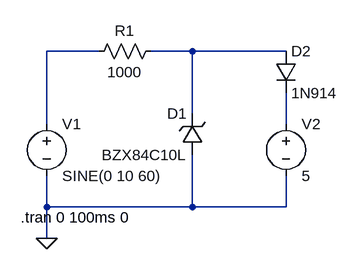
[diagram p0: schematic Sim_1.asc]
Sim_1.asc, the LTspice schematic file:
Version 4.1
SHEET 1 880 680
WIRE 160 0 80 0
WIRE 304 0 240 0
WIRE 448 0 304 0
WIRE 304 96 304 0
WIRE 80 112 80 0
WIRE 448 112 448 64
WIRE 80 240 80 192
WIRE 304 240 304 160
WIRE 304 240 80 240
WIRE 448 240 448 192
WIRE 448 240 304 240
WIRE 80 288 80 240
FLAG 80 288 0
SYMBOL voltage 80 96 R0
WINDOW 123 24 124 Left 2
WINDOW 39 0 0 Left 0
SYMATTR InstName V1
SYMATTR Value SINE(0 10 60)
SYMBOL voltage 448 96 R0
WINDOW 123 0 0 Left 0
WINDOW 39 0 0 Left 0
SYMATTR InstName V2
SYMATTR Value 5
SYMBOL res 256 -16 R90
WINDOW 0 0 56 VBottom 2
WINDOW 3 32 56 VTop 2
SYMATTR InstName R1
SYMATTR Value 1000
SYMBOL diode 432 0 R0
SYMATTR InstName D2
SYMATTR Value 1N914
SYMBOL zener 320 160 R180
WINDOW 0 24 64 Left 2
WINDOW 3 24 0 Left 2
SYMATTR InstName D1
SYMATTR Value BZX84C10L
TEXT 40 256 Left 2 !.tran 0 100ms 0

The netlist it stands for:
* Sim_1.asc
V1 N001 0 SINE(0 10 60)
V2 N003 0 5
R1 N002 N001 1000
D2 N002 N003 1N914
D1 0 N002 BZX84C10L
.model D D
.lib standard.dio
.tran 0 100ms 0
.backanno
.end